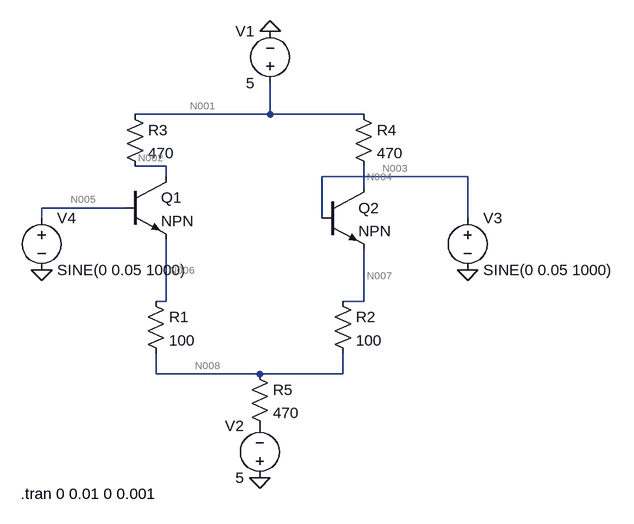
[diagram p0: schematic Draft1.asc]
Draft1.asc, the LTspice schematic file:
Version 4
SHEET 1 880 776
WIRE 208 176 208 128
WIRE 208 176 0 176
WIRE 352 176 208 176
WIRE 48 256 0 256
WIRE 48 272 48 256
WIRE 512 272 288 272
WIRE 352 288 352 256
WIRE -16 320 -144 320
WIRE -144 336 -144 320
WIRE 288 336 288 272
WIRE 512 336 512 272
WIRE 48 464 48 368
WIRE 48 464 32 464
WIRE 352 464 352 384
WIRE 352 464 320 464
WIRE 32 576 32 544
WIRE 192 576 32 576
WIRE 320 576 320 544
WIRE 320 576 192 576
FLAG 208 48 0
FLAG 512 416 0
FLAG -144 416 0
FLAG 192 736 0
SYMBOL voltage 208 144 R180
WINDOW 0 24 96 Left 2
WINDOW 3 24 16 Left 2
WINDOW 123 0 0 Left 0
WINDOW 39 0 0 Left 0
SYMATTR InstName V1
SYMATTR Value 5
SYMBOL res 16 448 R0
SYMATTR InstName R1
SYMATTR Value 100
SYMBOL res 304 448 R0
SYMATTR InstName R2
SYMATTR Value 100
SYMBOL npn -16 272 R0
SYMATTR InstName Q1
SYMBOL npn 288 288 R0
SYMATTR InstName Q2
SYMBOL voltage 512 320 R0
WINDOW 123 0 0 Left 0
WINDOW 39 0 0 Left 0
SYMATTR InstName V3
SYMATTR Value SINE(0 0.05 1000)
SYMBOL voltage -144 320 R0
WINDOW 123 0 0 Left 0
WINDOW 39 0 0 Left 0
SYMATTR InstName V4
SYMATTR Value SINE(0 0.05 1000)
SYMBOL res -16 160 R0
SYMATTR InstName R3
SYMATTR Value 470
SYMBOL res 336 160 R0
SYMATTR InstName R4
SYMATTR Value 470
SYMBOL res 176 560 R0
SYMATTR InstName R5
SYMATTR Value 470
SYMBOL voltage 192 752 R180
WINDOW 0 24 96 Left 2
WINDOW 3 24 16 Left 2
WINDOW 123 0 0 Left 0
WINDOW 39 0 0 Left 0
SYMATTR InstName V2
SYMATTR Value 5
TEXT -176 760 Left 2 !.tran 0 0.01 0 0.001

The netlist it stands for:
* Draft1.asc
V1 N001 0 5
R1 N006 N008 100
R2 N007 N008 100
Q1 N002 N005 N006 0 NPN
Q2 N004 N003 N007 0 NPN
V3 N003 0 SINE(0 0.05 1000)
V4 N005 0 SINE(0 0.05 1000)
R3 N001 N002 470
R4 N001 N004 470
R5 N008 P001 470
V2 0 P001 5
.model NPN NPN
.model PNP PNP
.lib standard.bjt
.tran 0 0.01 0 0.001
.backanno
.end

* Results of the author's LTspice run, read from the files saved beside the schematic
* Operating Point, zero values left out:
*   V(n001) = 5 V
*   V(n006) = -810 mV
*   V(n008) = -1.213 V
*   V(n007) = -810 mV
*   V(n002) = 3.125 V
*   V(n004) = 3.125 V
*   V(p001) = -5 V
*   Ic(Q2) = 3.989 mA
*   Ib(Q2) = 39.89 µA
*   Ie(Q2) = -4.029 mA
*   Ic(Q1) = 3.989 mA
*   Ib(Q1) = 39.89 µA
*   Ie(Q1) = -4.029 mA
*   I(R5) = 8.058 mA
*   I(R4) = 3.989 mA
*   I(R3) = 3.989 mA
*   I(R2) = 4.029 mA
*   I(R1) = 4.029 mA
*   I(V2) = -8.058 mA
*   I(V4) = -39.89 µA
*   I(V3) = -39.89 µA
*   I(V1) = -7.978 mA
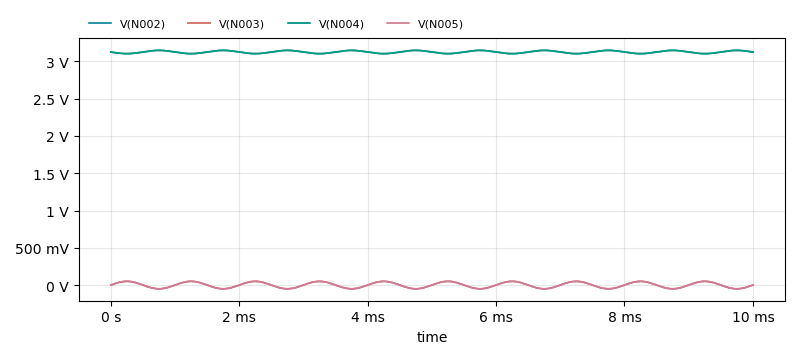
[diagram p1: Transient Analysis of Draft1.asc, plotted from the saved traces]
* Transient Analysis, 1 run:
*   V(N002): min 3.103 V, max 3.147 V, average 3.125 V, rms 3.125 V, last 3.125 V
*   V(N003): min -49.98 mV, max 49.98 mV, average 1.459 µV, rms 35.92 mV, last 0 V
*   V(N004): min 3.103 V, max 3.147 V, average 3.125 V, rms 3.125 V, last 3.125 V
*   V(N005): min -49.98 mV, max 49.98 mV, average 1.459 µV, rms 35.92 mV, last 0 V